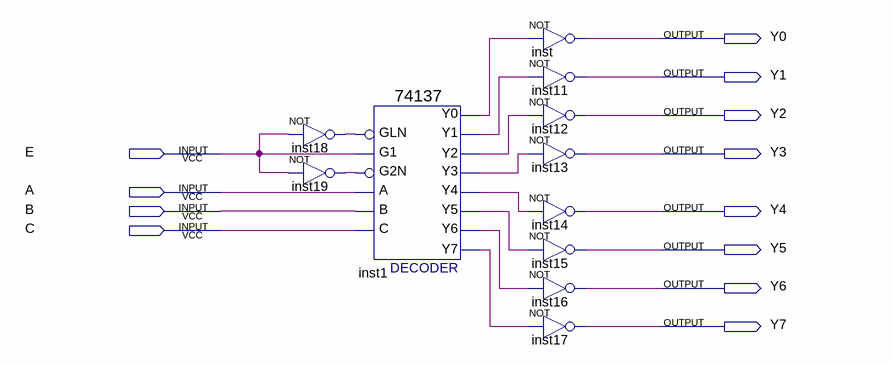
[diagram p0: schematic sheet]
// Quartus schematic REg.bdf as structural Verilog: 11 symbols, 12 pins
module REg (
  input  E,
  input  A,
  input  B,
  input  C,
  output Y0,
  output Y1,
  output Y2,
  output Y3,
  output Y4,
  output Y5,
  output Y6,
  output Y7
);

  wire inst1_y0, inst1_y1, inst1_y2, inst1_y3, inst1_y4, inst1_y5, inst1_y6, inst1_y7, inst18_out, inst19_out;

  not inst18 (inst18_out, E);
  not inst19 (inst19_out, E);
  \74137  inst1 (
    .GLN(inst18_out), .G1(E), .A(A), .G2N(inst19_out), .B(B), .C(C), .Y0(inst1_y0), .Y1(inst1_y1),
    .Y2(inst1_y2), .Y5(inst1_y5), .Y4(inst1_y4), .Y3(inst1_y3), .Y6(inst1_y6), .Y7(inst1_y7));
  not inst (Y0, inst1_y0);
  not inst11 (Y1, inst1_y1);
  not inst12 (Y2, inst1_y2);
  not inst13 (Y3, inst1_y3);
  not inst14 (Y4, inst1_y4);
  not inst15 (Y5, inst1_y5);
  not inst16 (Y6, inst1_y6);
  not inst17 (Y7, inst1_y7);
endmodule
